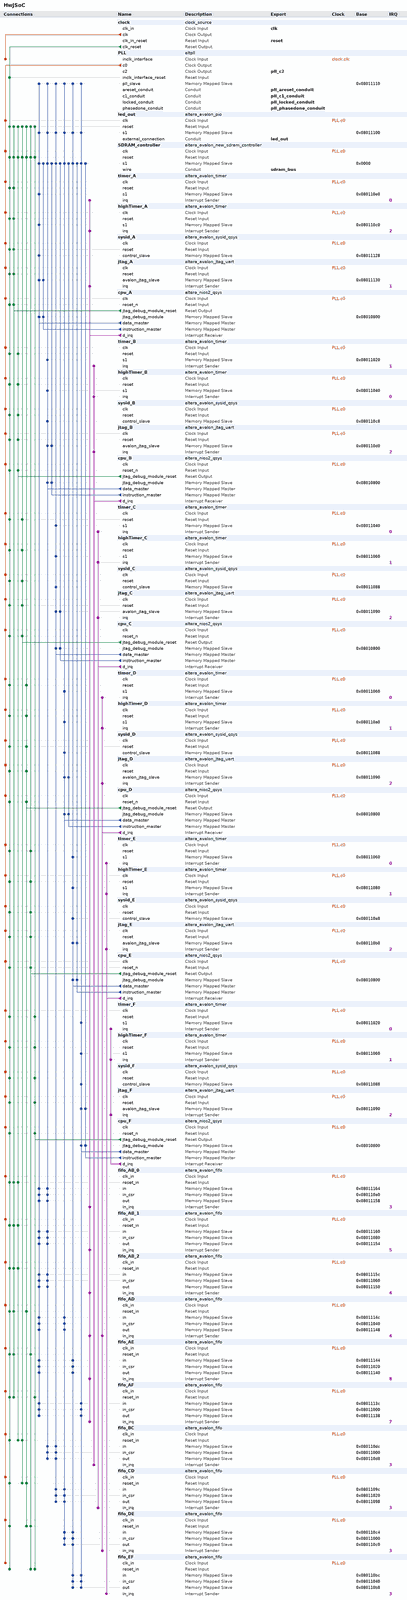
[diagram p0: system contents, whole]
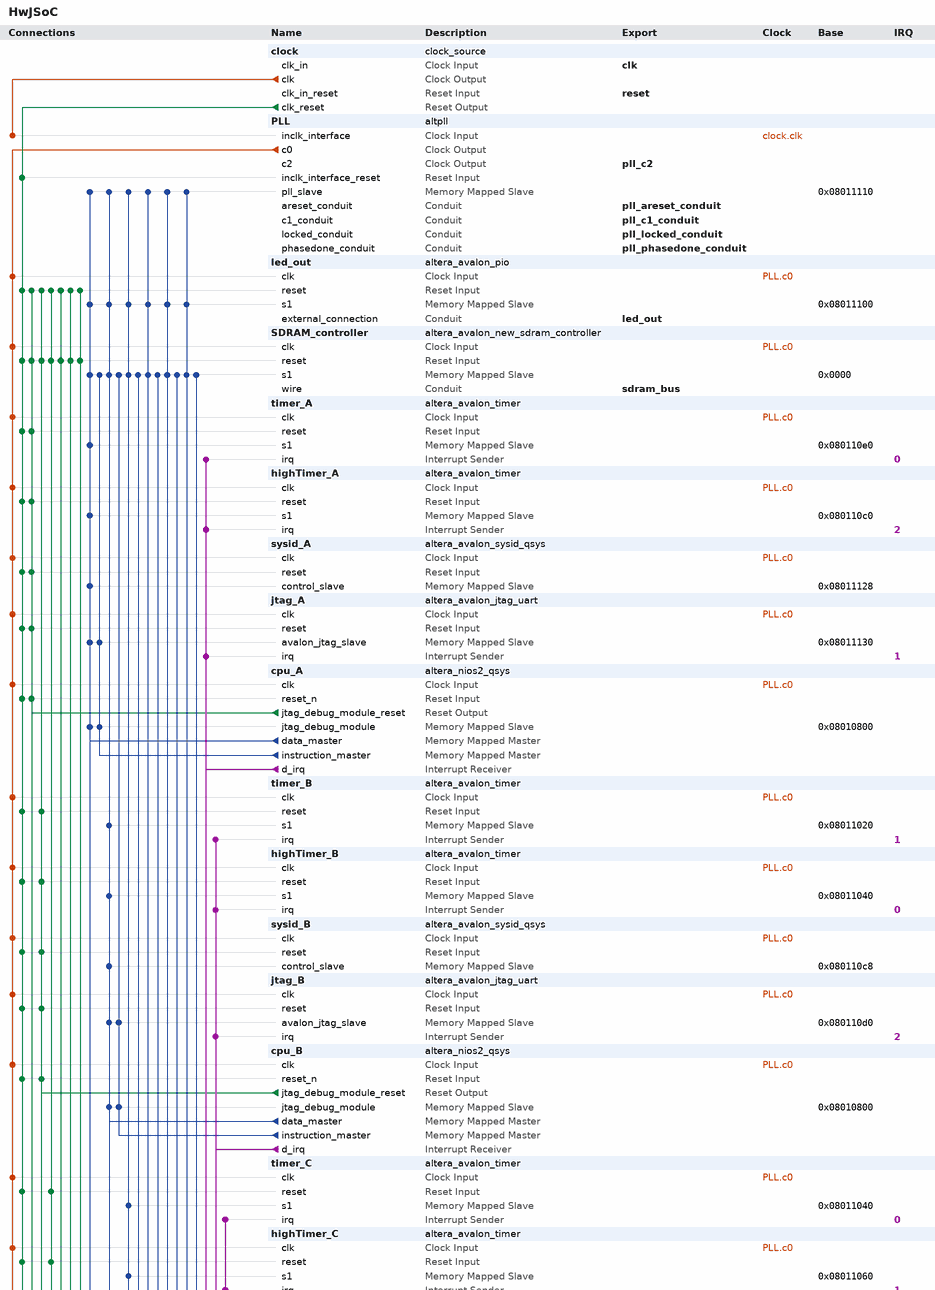
[diagram p1: system contents, upper part]
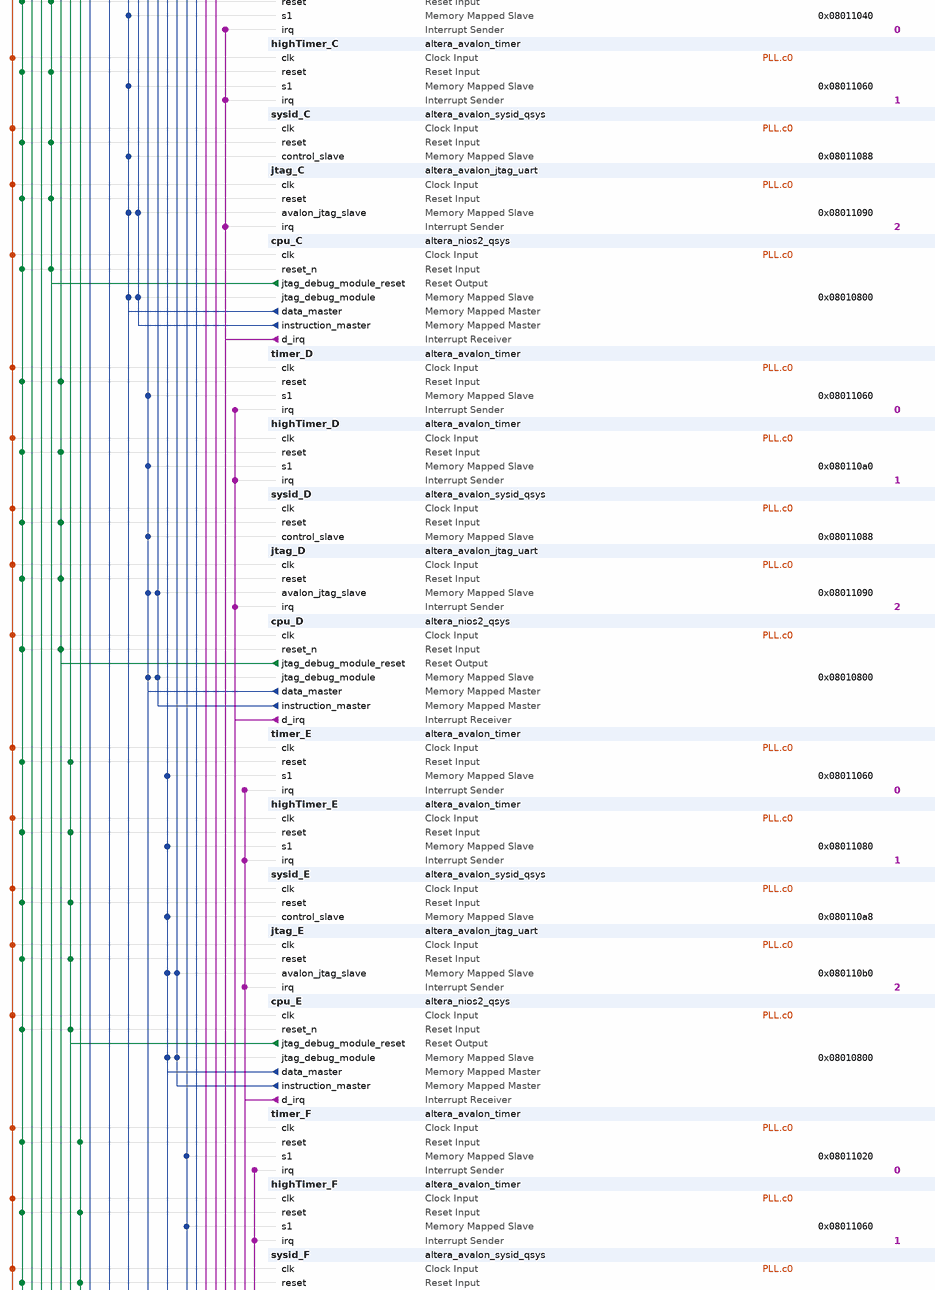
[diagram p2: system contents, middle part]
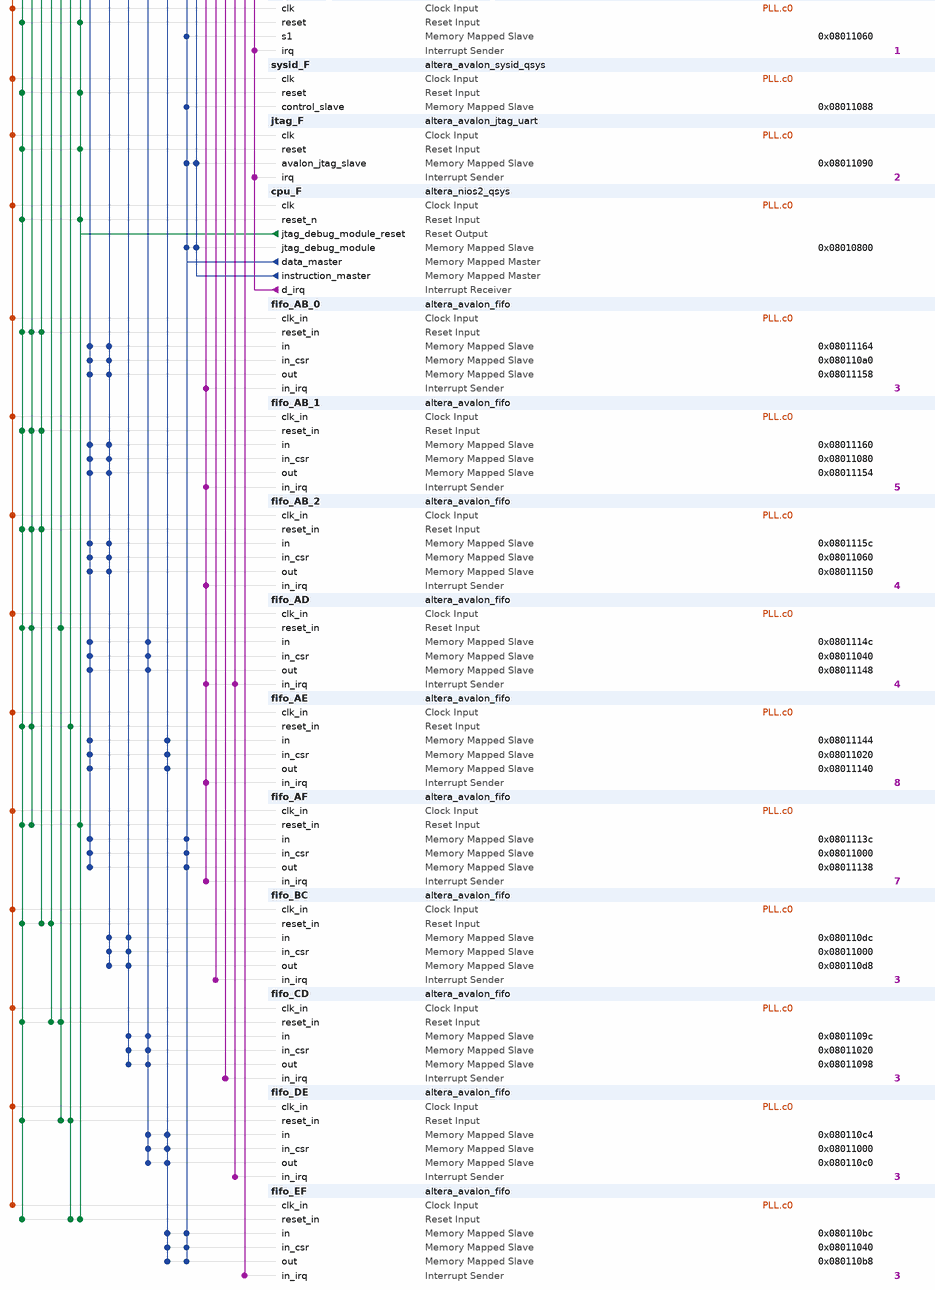
[diagram p3: system contents, lower part]
# Platform Designer (Qsys) system HwJSoC, Cyclone IV E EP4CE115F29C7
# Parameters at their usual value, and those the tool derives, are not listed.
package require -exact qsys 13.1
create_system HwJSoC
set_project_property DEVICE_FAMILY {Cyclone IV E}
set_project_property DEVICE EP4CE115F29C7

add_instance clock clock_source 13.1
set_instance_parameter_value clock clockFrequency 50000000

add_instance PLL altpll 13.1
set_instance_parameter_value PLL INCLK0_INPUT_FREQUENCY 10000
set_instance_parameter_value PLL CLK0_MULTIPLY_BY 1
set_instance_parameter_value PLL CLK1_MULTIPLY_BY 1
set_instance_parameter_value PLL CLK2_MULTIPLY_BY 1
set_instance_parameter_value PLL CLK0_DIVIDE_BY 1
set_instance_parameter_value PLL CLK1_DIVIDE_BY 10
set_instance_parameter_value PLL CLK2_DIVIDE_BY 1
set_instance_parameter_value PLL CLK1_PHASE_SHIFT 0
set_instance_parameter_value PLL CLK2_PHASE_SHIFT -1806
set_instance_parameter_value PLL CLK1_DUTY_CYCLE 50
set_instance_parameter_value PLL CLK2_DUTY_CYCLE 50
set_instance_parameter_value PLL PORT_clk1 PORT_UNUSED
set_instance_parameter_value PLL PORT_clk2 PORT_USED
set_instance_parameter_value PLL PORT_clk3 PORT_UNUSED
set_instance_parameter_value PLL PORT_ARESET PORT_USED
set_instance_parameter_value PLL PORT_LOCKED PORT_USED

add_instance led_out altera_avalon_pio 13.1
set_instance_parameter_value led_out direction Output
set_instance_parameter_value led_out width 8

add_instance SDRAM_controller altera_avalon_new_sdram_controller 13.1
set_instance_parameter_value SDRAM_controller TAC 6.0
set_instance_parameter_value SDRAM_controller TRCD 20.0
set_instance_parameter_value SDRAM_controller TRP 20.0
set_instance_parameter_value SDRAM_controller casLatency 3
set_instance_parameter_value SDRAM_controller columnWidth 10
set_instance_parameter_value SDRAM_controller dataWidth 32
set_instance_parameter_value SDRAM_controller generateSimulationModel false
set_instance_parameter_value SDRAM_controller model single_Micron_MT48LC4M32B2_7_chip
set_instance_parameter_value SDRAM_controller numberOfBanks 4
set_instance_parameter_value SDRAM_controller numberOfChipSelects 1
set_instance_parameter_value SDRAM_controller powerUpDelay 100.0
set_instance_parameter_value SDRAM_controller refreshPeriod 15.625
set_instance_parameter_value SDRAM_controller rowWidth 13

add_instance timer_A altera_avalon_timer 13.1
set_instance_parameter_value timer_A period 1
set_instance_parameter_value timer_A periodUnits MSEC

add_instance highTimer_A altera_avalon_timer 13.1
set_instance_parameter_value highTimer_A period 1
set_instance_parameter_value highTimer_A periodUnits USEC

add_instance sysid_A altera_avalon_sysid_qsys 13.1
set_instance_parameter_value sysid_A id 16

add_instance jtag_A altera_avalon_jtag_uart 13.1
set_instance_parameter_value jtag_A simInteractiveOptions NO_INTERACTIVE_WINDOWS

add_instance cpu_A altera_nios2_qsys 13.1
set_instance_parameter_value cpu_A resetSlave SDRAM_controller.s1
set_instance_parameter_value cpu_A mmu_TLBMissExcSlave None
set_instance_parameter_value cpu_A exceptionSlave SDRAM_controller.s1
set_instance_parameter_value cpu_A breakSlave cpu_A.jtag_debug_module
set_instance_parameter_value cpu_A muldiv_multiplierType NoneSmall
set_instance_parameter_value cpu_A impl Small
set_instance_parameter_value cpu_A icache_size 4096

add_instance timer_B altera_avalon_timer 13.1
set_instance_parameter_value timer_B period 1
set_instance_parameter_value timer_B periodUnits MSEC

add_instance highTimer_B altera_avalon_timer 13.1
set_instance_parameter_value highTimer_B period 1
set_instance_parameter_value highTimer_B periodUnits USEC

add_instance sysid_B altera_avalon_sysid_qsys 13.1
set_instance_parameter_value sysid_B id 16

add_instance jtag_B altera_avalon_jtag_uart 13.1
set_instance_parameter_value jtag_B simInteractiveOptions NO_INTERACTIVE_WINDOWS

add_instance cpu_B altera_nios2_qsys 13.1
set_instance_parameter_value cpu_B resetOffset 131072
set_instance_parameter_value cpu_B exceptionOffset 131104
set_instance_parameter_value cpu_B resetSlave SDRAM_controller.s1
set_instance_parameter_value cpu_B mmu_TLBMissExcSlave None
set_instance_parameter_value cpu_B exceptionSlave SDRAM_controller.s1
set_instance_parameter_value cpu_B breakSlave cpu_B.jtag_debug_module
set_instance_parameter_value cpu_B muldiv_multiplierType NoneSmall
set_instance_parameter_value cpu_B impl Small
set_instance_parameter_value cpu_B icache_size 4096

add_instance timer_C altera_avalon_timer 13.1
set_instance_parameter_value timer_C period 1
set_instance_parameter_value timer_C periodUnits MSEC

add_instance highTimer_C altera_avalon_timer 13.1
set_instance_parameter_value highTimer_C period 1
set_instance_parameter_value highTimer_C periodUnits USEC

add_instance sysid_C altera_avalon_sysid_qsys 13.1
set_instance_parameter_value sysid_C id 16

add_instance jtag_C altera_avalon_jtag_uart 13.1
set_instance_parameter_value jtag_C simInteractiveOptions NO_INTERACTIVE_WINDOWS

add_instance cpu_C altera_nios2_qsys 13.1
set_instance_parameter_value cpu_C resetOffset 262144
set_instance_parameter_value cpu_C exceptionOffset 262176
set_instance_parameter_value cpu_C resetSlave SDRAM_controller.s1
set_instance_parameter_value cpu_C mmu_TLBMissExcSlave None
set_instance_parameter_value cpu_C exceptionSlave SDRAM_controller.s1
set_instance_parameter_value cpu_C breakSlave cpu_C.jtag_debug_module
set_instance_parameter_value cpu_C impl Small
set_instance_parameter_value cpu_C icache_size 4096

add_instance timer_D altera_avalon_timer 13.1
set_instance_parameter_value timer_D period 1
set_instance_parameter_value timer_D periodUnits MSEC

add_instance highTimer_D altera_avalon_timer 13.1
set_instance_parameter_value highTimer_D period 1
set_instance_parameter_value highTimer_D periodUnits USEC

add_instance sysid_D altera_avalon_sysid_qsys 13.1
set_instance_parameter_value sysid_D id 16

add_instance jtag_D altera_avalon_jtag_uart 13.1
set_instance_parameter_value jtag_D simInteractiveOptions NO_INTERACTIVE_WINDOWS

add_instance cpu_D altera_nios2_qsys 13.1
set_instance_parameter_value cpu_D resetOffset 393216
set_instance_parameter_value cpu_D exceptionOffset 393248
set_instance_parameter_value cpu_D resetSlave SDRAM_controller.s1
set_instance_parameter_value cpu_D mmu_TLBMissExcSlave None
set_instance_parameter_value cpu_D exceptionSlave SDRAM_controller.s1
set_instance_parameter_value cpu_D breakSlave cpu_D.jtag_debug_module
set_instance_parameter_value cpu_D muldiv_multiplierType NoneSmall
set_instance_parameter_value cpu_D impl Small
set_instance_parameter_value cpu_D icache_size 4096

add_instance timer_E altera_avalon_timer 13.1
set_instance_parameter_value timer_E period 1
set_instance_parameter_value timer_E periodUnits MSEC

add_instance highTimer_E altera_avalon_timer 13.1
set_instance_parameter_value highTimer_E period 1
set_instance_parameter_value highTimer_E periodUnits USEC

add_instance sysid_E altera_avalon_sysid_qsys 13.1
set_instance_parameter_value sysid_E id 16

add_instance jtag_E altera_avalon_jtag_uart 13.1
set_instance_parameter_value jtag_E simInteractiveOptions NO_INTERACTIVE_WINDOWS

add_instance cpu_E altera_nios2_qsys 13.1
set_instance_parameter_value cpu_E resetOffset 524288
set_instance_parameter_value cpu_E exceptionOffset 524320
set_instance_parameter_value cpu_E resetSlave SDRAM_controller.s1
set_instance_parameter_value cpu_E mmu_TLBMissExcSlave None
set_instance_parameter_value cpu_E exceptionSlave SDRAM_controller.s1
set_instance_parameter_value cpu_E breakSlave cpu_E.jtag_debug_module
set_instance_parameter_value cpu_E muldiv_multiplierType NoneSmall
set_instance_parameter_value cpu_E impl Small
set_instance_parameter_value cpu_E icache_size 4096

add_instance timer_F altera_avalon_timer 13.1
set_instance_parameter_value timer_F period 1
set_instance_parameter_value timer_F periodUnits MSEC

add_instance highTimer_F altera_avalon_timer 13.1
set_instance_parameter_value highTimer_F period 1
set_instance_parameter_value highTimer_F periodUnits USEC

add_instance sysid_F altera_avalon_sysid_qsys 13.1
set_instance_parameter_value sysid_F id 16

add_instance jtag_F altera_avalon_jtag_uart 13.1
set_instance_parameter_value jtag_F simInteractiveOptions NO_INTERACTIVE_WINDOWS

add_instance cpu_F altera_nios2_qsys 13.1
set_instance_parameter_value cpu_F resetOffset 655360
set_instance_parameter_value cpu_F exceptionOffset 655392
set_instance_parameter_value cpu_F resetSlave SDRAM_controller.s1
set_instance_parameter_value cpu_F mmu_TLBMissExcSlave None
set_instance_parameter_value cpu_F exceptionSlave SDRAM_controller.s1
set_instance_parameter_value cpu_F breakSlave cpu_F.jtag_debug_module
set_instance_parameter_value cpu_F muldiv_multiplierType NoneSmall
set_instance_parameter_value cpu_F impl Small
set_instance_parameter_value cpu_F icache_size 4096

add_instance fifo_AB_0 altera_avalon_fifo 13.1
set_instance_parameter_value fifo_AB_0 bitsPerSymbol 16
set_instance_parameter_value fifo_AB_0 channelWidth 8
set_instance_parameter_value fifo_AB_0 errorWidth 8
set_instance_parameter_value fifo_AB_0 fifoDepth 128
set_instance_parameter_value fifo_AB_0 fifoInputInterfaceOptions AVALONMM_WRITE
set_instance_parameter_value fifo_AB_0 fifoOutputInterfaceOptions AVALONMM_READ
set_instance_parameter_value fifo_AB_0 singleClockMode true
set_instance_parameter_value fifo_AB_0 symbolsPerBeat 2
set_instance_parameter_value fifo_AB_0 useIRQ true
set_instance_parameter_value fifo_AB_0 usePacket true
set_instance_parameter_value fifo_AB_0 useReadControl false

add_instance fifo_AB_1 altera_avalon_fifo 13.1
set_instance_parameter_value fifo_AB_1 bitsPerSymbol 16
set_instance_parameter_value fifo_AB_1 channelWidth 8
set_instance_parameter_value fifo_AB_1 errorWidth 8
set_instance_parameter_value fifo_AB_1 fifoDepth 128
set_instance_parameter_value fifo_AB_1 fifoInputInterfaceOptions AVALONMM_WRITE
set_instance_parameter_value fifo_AB_1 fifoOutputInterfaceOptions AVALONMM_READ
set_instance_parameter_value fifo_AB_1 singleClockMode true
set_instance_parameter_value fifo_AB_1 symbolsPerBeat 2
set_instance_parameter_value fifo_AB_1 useIRQ true
set_instance_parameter_value fifo_AB_1 usePacket true
set_instance_parameter_value fifo_AB_1 useReadControl false

add_instance fifo_AB_2 altera_avalon_fifo 13.1
set_instance_parameter_value fifo_AB_2 bitsPerSymbol 16
set_instance_parameter_value fifo_AB_2 channelWidth 8
set_instance_parameter_value fifo_AB_2 errorWidth 8
set_instance_parameter_value fifo_AB_2 fifoDepth 128
set_instance_parameter_value fifo_AB_2 fifoInputInterfaceOptions AVALONMM_WRITE
set_instance_parameter_value fifo_AB_2 fifoOutputInterfaceOptions AVALONMM_READ
set_instance_parameter_value fifo_AB_2 singleClockMode true
set_instance_parameter_value fifo_AB_2 symbolsPerBeat 2
set_instance_parameter_value fifo_AB_2 useIRQ true
set_instance_parameter_value fifo_AB_2 usePacket true
set_instance_parameter_value fifo_AB_2 useReadControl false

add_instance fifo_AD altera_avalon_fifo 13.1
set_instance_parameter_value fifo_AD bitsPerSymbol 16
set_instance_parameter_value fifo_AD channelWidth 8
set_instance_parameter_value fifo_AD errorWidth 8
set_instance_parameter_value fifo_AD fifoDepth 32
set_instance_parameter_value fifo_AD fifoInputInterfaceOptions AVALONMM_WRITE
set_instance_parameter_value fifo_AD fifoOutputInterfaceOptions AVALONMM_READ
set_instance_parameter_value fifo_AD singleClockMode true
set_instance_parameter_value fifo_AD symbolsPerBeat 2
set_instance_parameter_value fifo_AD useIRQ true
set_instance_parameter_value fifo_AD usePacket true
set_instance_parameter_value fifo_AD useReadControl false

add_instance fifo_AE altera_avalon_fifo 13.1
set_instance_parameter_value fifo_AE bitsPerSymbol 16
set_instance_parameter_value fifo_AE channelWidth 8
set_instance_parameter_value fifo_AE errorWidth 8
set_instance_parameter_value fifo_AE fifoDepth 32
set_instance_parameter_value fifo_AE fifoInputInterfaceOptions AVALONMM_WRITE
set_instance_parameter_value fifo_AE fifoOutputInterfaceOptions AVALONMM_READ
set_instance_parameter_value fifo_AE singleClockMode true
set_instance_parameter_value fifo_AE symbolsPerBeat 2
set_instance_parameter_value fifo_AE useIRQ true
set_instance_parameter_value fifo_AE usePacket true
set_instance_parameter_value fifo_AE useReadControl false

add_instance fifo_AF altera_avalon_fifo 13.1
set_instance_parameter_value fifo_AF bitsPerSymbol 16
set_instance_parameter_value fifo_AF channelWidth 8
set_instance_parameter_value fifo_AF errorWidth 8
set_instance_parameter_value fifo_AF fifoDepth 32
set_instance_parameter_value fifo_AF fifoInputInterfaceOptions AVALONMM_WRITE
set_instance_parameter_value fifo_AF fifoOutputInterfaceOptions AVALONMM_READ
set_instance_parameter_value fifo_AF singleClockMode true
set_instance_parameter_value fifo_AF symbolsPerBeat 2
set_instance_parameter_value fifo_AF useIRQ true
set_instance_parameter_value fifo_AF usePacket true
set_instance_parameter_value fifo_AF useReadControl false

add_instance fifo_BC altera_avalon_fifo 13.1
set_instance_parameter_value fifo_BC bitsPerSymbol 16
set_instance_parameter_value fifo_BC channelWidth 8
set_instance_parameter_value fifo_BC errorWidth 8
set_instance_parameter_value fifo_BC fifoDepth 256
set_instance_parameter_value fifo_BC fifoInputInterfaceOptions AVALONMM_WRITE
set_instance_parameter_value fifo_BC fifoOutputInterfaceOptions AVALONMM_READ
set_instance_parameter_value fifo_BC singleClockMode true
set_instance_parameter_value fifo_BC symbolsPerBeat 2
set_instance_parameter_value fifo_BC useIRQ true
set_instance_parameter_value fifo_BC usePacket true
set_instance_parameter_value fifo_BC useReadControl false

add_instance fifo_CD altera_avalon_fifo 13.1
set_instance_parameter_value fifo_CD bitsPerSymbol 16
set_instance_parameter_value fifo_CD channelWidth 8
set_instance_parameter_value fifo_CD errorWidth 8
set_instance_parameter_value fifo_CD fifoDepth 256
set_instance_parameter_value fifo_CD fifoInputInterfaceOptions AVALONMM_WRITE
set_instance_parameter_value fifo_CD fifoOutputInterfaceOptions AVALONMM_READ
set_instance_parameter_value fifo_CD singleClockMode true
set_instance_parameter_value fifo_CD symbolsPerBeat 2
set_instance_parameter_value fifo_CD useIRQ true
set_instance_parameter_value fifo_CD usePacket true
set_instance_parameter_value fifo_CD useReadControl false

add_instance fifo_DE altera_avalon_fifo 13.1
set_instance_parameter_value fifo_DE bitsPerSymbol 16
set_instance_parameter_value fifo_DE channelWidth 8
set_instance_parameter_value fifo_DE errorWidth 8
set_instance_parameter_value fifo_DE fifoDepth 256
set_instance_parameter_value fifo_DE fifoInputInterfaceOptions AVALONMM_WRITE
set_instance_parameter_value fifo_DE fifoOutputInterfaceOptions AVALONMM_READ
set_instance_parameter_value fifo_DE singleClockMode true
set_instance_parameter_value fifo_DE symbolsPerBeat 2
set_instance_parameter_value fifo_DE useIRQ true
set_instance_parameter_value fifo_DE usePacket true
set_instance_parameter_value fifo_DE useReadControl false

add_instance fifo_EF altera_avalon_fifo 13.1
set_instance_parameter_value fifo_EF bitsPerSymbol 16
set_instance_parameter_value fifo_EF channelWidth 8
set_instance_parameter_value fifo_EF errorWidth 8
set_instance_parameter_value fifo_EF fifoDepth 512
set_instance_parameter_value fifo_EF fifoInputInterfaceOptions AVALONMM_WRITE
set_instance_parameter_value fifo_EF fifoOutputInterfaceOptions AVALONMM_READ
set_instance_parameter_value fifo_EF singleClockMode true
set_instance_parameter_value fifo_EF symbolsPerBeat 2
set_instance_parameter_value fifo_EF useIRQ true
set_instance_parameter_value fifo_EF usePacket true
set_instance_parameter_value fifo_EF useReadControl false

# connections
add_connection clock.clk PLL.inclk_interface clock
add_connection PLL.c0 cpu_A.clk clock
add_connection PLL.c0 cpu_B.clk clock
add_connection PLL.c0 cpu_C.clk clock
add_connection PLL.c0 cpu_D.clk clock
add_connection PLL.c0 cpu_E.clk clock
add_connection PLL.c0 cpu_F.clk clock
add_connection PLL.c0 fifo_AB_0.clk_in clock
add_connection PLL.c0 fifo_AB_1.clk_in clock
add_connection PLL.c0 fifo_AB_2.clk_in clock
add_connection PLL.c0 fifo_AD.clk_in clock
add_connection PLL.c0 fifo_AE.clk_in clock
add_connection PLL.c0 fifo_AF.clk_in clock
add_connection PLL.c0 fifo_BC.clk_in clock
add_connection PLL.c0 fifo_CD.clk_in clock
add_connection PLL.c0 fifo_DE.clk_in clock
add_connection PLL.c0 fifo_EF.clk_in clock
add_connection PLL.c0 highTimer_A.clk clock
add_connection PLL.c0 highTimer_B.clk clock
add_connection PLL.c0 highTimer_C.clk clock
add_connection PLL.c0 highTimer_D.clk clock
add_connection PLL.c0 highTimer_E.clk clock
add_connection PLL.c0 highTimer_F.clk clock
add_connection PLL.c0 jtag_A.clk clock
add_connection PLL.c0 jtag_B.clk clock
add_connection PLL.c0 jtag_C.clk clock
add_connection PLL.c0 jtag_D.clk clock
add_connection PLL.c0 jtag_E.clk clock
add_connection PLL.c0 jtag_F.clk clock
add_connection PLL.c0 led_out.clk clock
add_connection PLL.c0 SDRAM_controller.clk clock
add_connection PLL.c0 sysid_A.clk clock
add_connection PLL.c0 sysid_B.clk clock
add_connection PLL.c0 sysid_C.clk clock
add_connection PLL.c0 sysid_D.clk clock
add_connection PLL.c0 sysid_E.clk clock
add_connection PLL.c0 sysid_F.clk clock
add_connection PLL.c0 timer_A.clk clock
add_connection PLL.c0 timer_B.clk clock
add_connection PLL.c0 timer_C.clk clock
add_connection PLL.c0 timer_D.clk clock
add_connection PLL.c0 timer_E.clk clock
add_connection PLL.c0 timer_F.clk clock
add_connection clock.clk_reset cpu_A.reset_n reset
add_connection clock.clk_reset cpu_B.reset_n reset
add_connection clock.clk_reset cpu_C.reset_n reset
add_connection clock.clk_reset cpu_D.reset_n reset
add_connection clock.clk_reset cpu_E.reset_n reset
add_connection clock.clk_reset cpu_F.reset_n reset
add_connection clock.clk_reset fifo_AB_0.reset_in reset
add_connection clock.clk_reset fifo_AB_1.reset_in reset
add_connection clock.clk_reset fifo_AB_2.reset_in reset
add_connection clock.clk_reset fifo_AD.reset_in reset
add_connection clock.clk_reset fifo_AE.reset_in reset
add_connection clock.clk_reset fifo_AF.reset_in reset
add_connection clock.clk_reset fifo_BC.reset_in reset
add_connection clock.clk_reset fifo_CD.reset_in reset
add_connection clock.clk_reset fifo_DE.reset_in reset
add_connection clock.clk_reset fifo_EF.reset_in reset
add_connection clock.clk_reset highTimer_A.reset reset
add_connection clock.clk_reset highTimer_B.reset reset
add_connection clock.clk_reset highTimer_C.reset reset
add_connection clock.clk_reset highTimer_D.reset reset
add_connection clock.clk_reset highTimer_E.reset reset
add_connection clock.clk_reset highTimer_F.reset reset
add_connection clock.clk_reset jtag_A.reset reset
add_connection clock.clk_reset jtag_B.reset reset
add_connection clock.clk_reset jtag_C.reset reset
add_connection clock.clk_reset jtag_D.reset reset
add_connection clock.clk_reset jtag_E.reset reset
add_connection clock.clk_reset jtag_F.reset reset
add_connection clock.clk_reset led_out.reset reset
add_connection clock.clk_reset PLL.inclk_interface_reset reset
add_connection clock.clk_reset SDRAM_controller.reset reset
add_connection clock.clk_reset sysid_A.reset reset
add_connection clock.clk_reset sysid_B.reset reset
add_connection clock.clk_reset sysid_C.reset reset
add_connection clock.clk_reset sysid_D.reset reset
add_connection clock.clk_reset sysid_E.reset reset
add_connection clock.clk_reset sysid_F.reset reset
add_connection clock.clk_reset timer_A.reset reset
add_connection clock.clk_reset timer_B.reset reset
add_connection clock.clk_reset timer_C.reset reset
add_connection clock.clk_reset timer_D.reset reset
add_connection clock.clk_reset timer_E.reset reset
add_connection clock.clk_reset timer_F.reset reset
add_connection cpu_A.jtag_debug_module_reset cpu_A.reset_n reset
add_connection cpu_A.jtag_debug_module_reset fifo_AB_0.reset_in reset
add_connection cpu_A.jtag_debug_module_reset fifo_AB_1.reset_in reset
add_connection cpu_A.jtag_debug_module_reset fifo_AB_2.reset_in reset
add_connection cpu_A.jtag_debug_module_reset fifo_AD.reset_in reset
add_connection cpu_A.jtag_debug_module_reset fifo_AE.reset_in reset
add_connection cpu_A.jtag_debug_module_reset fifo_AF.reset_in reset
add_connection cpu_A.jtag_debug_module_reset highTimer_A.reset reset
add_connection cpu_A.jtag_debug_module_reset jtag_A.reset reset
add_connection cpu_A.jtag_debug_module_reset led_out.reset reset
add_connection cpu_A.jtag_debug_module_reset SDRAM_controller.reset reset
add_connection cpu_A.jtag_debug_module_reset sysid_A.reset reset
add_connection cpu_A.jtag_debug_module_reset timer_A.reset reset
add_connection cpu_B.jtag_debug_module_reset cpu_B.reset_n reset
add_connection cpu_B.jtag_debug_module_reset fifo_AB_0.reset_in reset
add_connection cpu_B.jtag_debug_module_reset fifo_AB_1.reset_in reset
add_connection cpu_B.jtag_debug_module_reset fifo_AB_2.reset_in reset
add_connection cpu_B.jtag_debug_module_reset fifo_BC.reset_in reset
add_connection cpu_B.jtag_debug_module_reset highTimer_B.reset reset
add_connection cpu_B.jtag_debug_module_reset jtag_B.reset reset
add_connection cpu_B.jtag_debug_module_reset led_out.reset reset
add_connection cpu_B.jtag_debug_module_reset SDRAM_controller.reset reset
add_connection cpu_B.jtag_debug_module_reset sysid_B.reset reset
add_connection cpu_B.jtag_debug_module_reset timer_B.reset reset
add_connection cpu_C.jtag_debug_module_reset cpu_C.reset_n reset
add_connection cpu_C.jtag_debug_module_reset fifo_BC.reset_in reset
add_connection cpu_C.jtag_debug_module_reset fifo_CD.reset_in reset
add_connection cpu_C.jtag_debug_module_reset highTimer_C.reset reset
add_connection cpu_C.jtag_debug_module_reset jtag_C.reset reset
add_connection cpu_C.jtag_debug_module_reset led_out.reset reset
add_connection cpu_C.jtag_debug_module_reset SDRAM_controller.reset reset
add_connection cpu_C.jtag_debug_module_reset sysid_C.reset reset
add_connection cpu_C.jtag_debug_module_reset timer_C.reset reset
add_connection cpu_D.jtag_debug_module_reset cpu_D.reset_n reset
add_connection cpu_D.jtag_debug_module_reset fifo_AD.reset_in reset
add_connection cpu_D.jtag_debug_module_reset fifo_CD.reset_in reset
add_connection cpu_D.jtag_debug_module_reset fifo_DE.reset_in reset
add_connection cpu_D.jtag_debug_module_reset highTimer_D.reset reset
add_connection cpu_D.jtag_debug_module_reset jtag_D.reset reset
add_connection cpu_D.jtag_debug_module_reset led_out.reset reset
add_connection cpu_D.jtag_debug_module_reset SDRAM_controller.reset reset
add_connection cpu_D.jtag_debug_module_reset sysid_D.reset reset
add_connection cpu_D.jtag_debug_module_reset timer_D.reset reset
add_connection cpu_E.jtag_debug_module_reset cpu_E.reset_n reset
add_connection cpu_E.jtag_debug_module_reset fifo_AE.reset_in reset
add_connection cpu_E.jtag_debug_module_reset fifo_DE.reset_in reset
add_connection cpu_E.jtag_debug_module_reset fifo_EF.reset_in reset
add_connection cpu_E.jtag_debug_module_reset highTimer_E.reset reset
add_connection cpu_E.jtag_debug_module_reset jtag_E.reset reset
add_connection cpu_E.jtag_debug_module_reset led_out.reset reset
add_connection cpu_E.jtag_debug_module_reset SDRAM_controller.reset reset
add_connection cpu_E.jtag_debug_module_reset sysid_E.reset reset
add_connection cpu_E.jtag_debug_module_reset timer_E.reset reset
add_connection cpu_F.jtag_debug_module_reset cpu_F.reset_n reset
add_connection cpu_F.jtag_debug_module_reset fifo_AF.reset_in reset
add_connection cpu_F.jtag_debug_module_reset fifo_EF.reset_in reset
add_connection cpu_F.jtag_debug_module_reset highTimer_F.reset reset
add_connection cpu_F.jtag_debug_module_reset jtag_F.reset reset
add_connection cpu_F.jtag_debug_module_reset led_out.reset reset
add_connection cpu_F.jtag_debug_module_reset SDRAM_controller.reset reset
add_connection cpu_F.jtag_debug_module_reset sysid_F.reset reset
add_connection cpu_F.jtag_debug_module_reset timer_F.reset reset
add_connection cpu_A.data_master cpu_A.jtag_debug_module avalon
set_connection_parameter_value cpu_A.data_master/cpu_A.jtag_debug_module baseAddress 0x08010800
add_connection cpu_A.data_master fifo_AB_0.in avalon
set_connection_parameter_value cpu_A.data_master/fifo_AB_0.in baseAddress 0x08011164
add_connection cpu_A.data_master fifo_AB_0.in_csr avalon
set_connection_parameter_value cpu_A.data_master/fifo_AB_0.in_csr baseAddress 0x080110a0
add_connection cpu_A.data_master fifo_AB_0.out avalon
set_connection_parameter_value cpu_A.data_master/fifo_AB_0.out baseAddress 0x08011158
add_connection cpu_A.data_master fifo_AB_1.in avalon
set_connection_parameter_value cpu_A.data_master/fifo_AB_1.in baseAddress 0x08011160
add_connection cpu_A.data_master fifo_AB_1.in_csr avalon
set_connection_parameter_value cpu_A.data_master/fifo_AB_1.in_csr baseAddress 0x08011080
add_connection cpu_A.data_master fifo_AB_1.out avalon
set_connection_parameter_value cpu_A.data_master/fifo_AB_1.out baseAddress 0x08011154
add_connection cpu_A.data_master fifo_AB_2.in avalon
set_connection_parameter_value cpu_A.data_master/fifo_AB_2.in baseAddress 0x0801115c
add_connection cpu_A.data_master fifo_AB_2.in_csr avalon
set_connection_parameter_value cpu_A.data_master/fifo_AB_2.in_csr baseAddress 0x08011060
add_connection cpu_A.data_master fifo_AB_2.out avalon
set_connection_parameter_value cpu_A.data_master/fifo_AB_2.out baseAddress 0x08011150
add_connection cpu_A.data_master fifo_AD.in avalon
set_connection_parameter_value cpu_A.data_master/fifo_AD.in baseAddress 0x0801114c
add_connection cpu_A.data_master fifo_AD.in_csr avalon
set_connection_parameter_value cpu_A.data_master/fifo_AD.in_csr baseAddress 0x08011040
add_connection cpu_A.data_master fifo_AD.out avalon
set_connection_parameter_value cpu_A.data_master/fifo_AD.out baseAddress 0x08011148
add_connection cpu_A.data_master fifo_AE.in avalon
set_connection_parameter_value cpu_A.data_master/fifo_AE.in baseAddress 0x08011144
add_connection cpu_A.data_master fifo_AE.in_csr avalon
set_connection_parameter_value cpu_A.data_master/fifo_AE.in_csr baseAddress 0x08011020
add_connection cpu_A.data_master fifo_AE.out avalon
set_connection_parameter_value cpu_A.data_master/fifo_AE.out baseAddress 0x08011140
add_connection cpu_A.data_master fifo_AF.in avalon
set_connection_parameter_value cpu_A.data_master/fifo_AF.in baseAddress 0x0801113c
add_connection cpu_A.data_master fifo_AF.in_csr avalon
set_connection_parameter_value cpu_A.data_master/fifo_AF.in_csr baseAddress 0x08011000
add_connection cpu_A.data_master fifo_AF.out avalon
set_connection_parameter_value cpu_A.data_master/fifo_AF.out baseAddress 0x08011138
add_connection cpu_A.data_master highTimer_A.s1 avalon
set_connection_parameter_value cpu_A.data_master/highTimer_A.s1 baseAddress 0x080110c0
add_connection cpu_A.data_master jtag_A.avalon_jtag_slave avalon
set_connection_parameter_value cpu_A.data_master/jtag_A.avalon_jtag_slave baseAddress 0x08011130
add_connection cpu_A.data_master led_out.s1 avalon
set_connection_parameter_value cpu_A.data_master/led_out.s1 baseAddress 0x08011100
add_connection cpu_A.data_master PLL.pll_slave avalon
set_connection_parameter_value cpu_A.data_master/PLL.pll_slave baseAddress 0x08011110
add_connection cpu_A.data_master SDRAM_controller.s1 avalon
set_connection_parameter_value cpu_A.data_master/SDRAM_controller.s1 baseAddress 0x0000
add_connection cpu_A.data_master sysid_A.control_slave avalon
set_connection_parameter_value cpu_A.data_master/sysid_A.control_slave baseAddress 0x08011128
add_connection cpu_A.data_master timer_A.s1 avalon
set_connection_parameter_value cpu_A.data_master/timer_A.s1 baseAddress 0x080110e0
add_connection cpu_A.instruction_master cpu_A.jtag_debug_module avalon
set_connection_parameter_value cpu_A.instruction_master/cpu_A.jtag_debug_module baseAddress 0x08010800
add_connection cpu_A.instruction_master jtag_A.avalon_jtag_slave avalon
set_connection_parameter_value cpu_A.instruction_master/jtag_A.avalon_jtag_slave baseAddress 0x08011130
add_connection cpu_A.instruction_master SDRAM_controller.s1 avalon
set_connection_parameter_value cpu_A.instruction_master/SDRAM_controller.s1 baseAddress 0x0000
add_connection cpu_B.data_master cpu_B.jtag_debug_module avalon
set_connection_parameter_value cpu_B.data_master/cpu_B.jtag_debug_module baseAddress 0x08010800
add_connection cpu_B.data_master fifo_AB_0.in avalon
set_connection_parameter_value cpu_B.data_master/fifo_AB_0.in baseAddress 0x08011164
add_connection cpu_B.data_master fifo_AB_0.in_csr avalon
set_connection_parameter_value cpu_B.data_master/fifo_AB_0.in_csr baseAddress 0x080110a0
add_connection cpu_B.data_master fifo_AB_0.out avalon
set_connection_parameter_value cpu_B.data_master/fifo_AB_0.out baseAddress 0x08011158
add_connection cpu_B.data_master fifo_AB_1.in avalon
set_connection_parameter_value cpu_B.data_master/fifo_AB_1.in baseAddress 0x08011160
add_connection cpu_B.data_master fifo_AB_1.in_csr avalon
set_connection_parameter_value cpu_B.data_master/fifo_AB_1.in_csr baseAddress 0x08011080
add_connection cpu_B.data_master fifo_AB_1.out avalon
set_connection_parameter_value cpu_B.data_master/fifo_AB_1.out baseAddress 0x08011154
add_connection cpu_B.data_master fifo_AB_2.in avalon
set_connection_parameter_value cpu_B.data_master/fifo_AB_2.in baseAddress 0x0801115c
add_connection cpu_B.data_master fifo_AB_2.in_csr avalon
set_connection_parameter_value cpu_B.data_master/fifo_AB_2.in_csr baseAddress 0x08011060
add_connection cpu_B.data_master fifo_AB_2.out avalon
set_connection_parameter_value cpu_B.data_master/fifo_AB_2.out baseAddress 0x08011150
add_connection cpu_B.data_master fifo_BC.in avalon
set_connection_parameter_value cpu_B.data_master/fifo_BC.in baseAddress 0x080110dc
add_connection cpu_B.data_master fifo_BC.in_csr avalon
set_connection_parameter_value cpu_B.data_master/fifo_BC.in_csr baseAddress 0x08011000
add_connection cpu_B.data_master fifo_BC.out avalon
set_connection_parameter_value cpu_B.data_master/fifo_BC.out baseAddress 0x080110d8
add_connection cpu_B.data_master highTimer_B.s1 avalon
set_connection_parameter_value cpu_B.data_master/highTimer_B.s1 baseAddress 0x08011040
add_connection cpu_B.data_master jtag_B.avalon_jtag_slave avalon
set_connection_parameter_value cpu_B.data_master/jtag_B.avalon_jtag_slave baseAddress 0x080110d0
add_connection cpu_B.data_master led_out.s1 avalon
set_connection_parameter_value cpu_B.data_master/led_out.s1 baseAddress 0x08011100
add_connection cpu_B.data_master PLL.pll_slave avalon
set_connection_parameter_value cpu_B.data_master/PLL.pll_slave baseAddress 0x08011110
add_connection cpu_B.data_master SDRAM_controller.s1 avalon
set_connection_parameter_value cpu_B.data_master/SDRAM_controller.s1 baseAddress 0x0000
add_connection cpu_B.data_master sysid_B.control_slave avalon
set_connection_parameter_value cpu_B.data_master/sysid_B.control_slave baseAddress 0x080110c8
add_connection cpu_B.data_master timer_B.s1 avalon
set_connection_parameter_value cpu_B.data_master/timer_B.s1 baseAddress 0x08011020
add_connection cpu_B.instruction_master cpu_B.jtag_debug_module avalon
set_connection_parameter_value cpu_B.instruction_master/cpu_B.jtag_debug_module baseAddress 0x08010800
add_connection cpu_B.instruction_master jtag_B.avalon_jtag_slave avalon
set_connection_parameter_value cpu_B.instruction_master/jtag_B.avalon_jtag_slave baseAddress 0x080110d0
add_connection cpu_B.instruction_master SDRAM_controller.s1 avalon
set_connection_parameter_value cpu_B.instruction_master/SDRAM_controller.s1 baseAddress 0x0000
add_connection cpu_C.data_master cpu_C.jtag_debug_module avalon
set_connection_parameter_value cpu_C.data_master/cpu_C.jtag_debug_module baseAddress 0x08010800
add_connection cpu_C.data_master fifo_BC.in avalon
set_connection_parameter_value cpu_C.data_master/fifo_BC.in baseAddress 0x080110dc
add_connection cpu_C.data_master fifo_BC.in_csr avalon
set_connection_parameter_value cpu_C.data_master/fifo_BC.in_csr baseAddress 0x08011000
add_connection cpu_C.data_master fifo_BC.out avalon
set_connection_parameter_value cpu_C.data_master/fifo_BC.out baseAddress 0x080110d8
add_connection cpu_C.data_master fifo_CD.in avalon
set_connection_parameter_value cpu_C.data_master/fifo_CD.in baseAddress 0x0801109c
add_connection cpu_C.data_master fifo_CD.in_csr avalon
set_connection_parameter_value cpu_C.data_master/fifo_CD.in_csr baseAddress 0x08011020
add_connection cpu_C.data_master fifo_CD.out avalon
set_connection_parameter_value cpu_C.data_master/fifo_CD.out baseAddress 0x08011098
add_connection cpu_C.data_master highTimer_C.s1 avalon
set_connection_parameter_value cpu_C.data_master/highTimer_C.s1 baseAddress 0x08011060
add_connection cpu_C.data_master jtag_C.avalon_jtag_slave avalon
set_connection_parameter_value cpu_C.data_master/jtag_C.avalon_jtag_slave baseAddress 0x08011090
add_connection cpu_C.data_master led_out.s1 avalon
set_connection_parameter_value cpu_C.data_master/led_out.s1 baseAddress 0x08011100
add_connection cpu_C.data_master PLL.pll_slave avalon
set_connection_parameter_value cpu_C.data_master/PLL.pll_slave baseAddress 0x08011110
add_connection cpu_C.data_master SDRAM_controller.s1 avalon
set_connection_parameter_value cpu_C.data_master/SDRAM_controller.s1 baseAddress 0x0000
add_connection cpu_C.data_master sysid_C.control_slave avalon
set_connection_parameter_value cpu_C.data_master/sysid_C.control_slave baseAddress 0x08011088
add_connection cpu_C.data_master timer_C.s1 avalon
set_connection_parameter_value cpu_C.data_master/timer_C.s1 baseAddress 0x08011040
add_connection cpu_C.instruction_master cpu_C.jtag_debug_module avalon
set_connection_parameter_value cpu_C.instruction_master/cpu_C.jtag_debug_module baseAddress 0x08010800
add_connection cpu_C.instruction_master jtag_C.avalon_jtag_slave avalon
set_connection_parameter_value cpu_C.instruction_master/jtag_C.avalon_jtag_slave baseAddress 0x08011090
add_connection cpu_C.instruction_master SDRAM_controller.s1 avalon
set_connection_parameter_value cpu_C.instruction_master/SDRAM_controller.s1 baseAddress 0x0000
add_connection cpu_D.data_master cpu_D.jtag_debug_module avalon
set_connection_parameter_value cpu_D.data_master/cpu_D.jtag_debug_module baseAddress 0x08010800
add_connection cpu_D.data_master fifo_AD.in avalon
set_connection_parameter_value cpu_D.data_master/fifo_AD.in baseAddress 0x0801114c
add_connection cpu_D.data_master fifo_AD.in_csr avalon
set_connection_parameter_value cpu_D.data_master/fifo_AD.in_csr baseAddress 0x08011040
add_connection cpu_D.data_master fifo_AD.out avalon
set_connection_parameter_value cpu_D.data_master/fifo_AD.out baseAddress 0x08011148
add_connection cpu_D.data_master fifo_CD.in avalon
set_connection_parameter_value cpu_D.data_master/fifo_CD.in baseAddress 0x0801109c
add_connection cpu_D.data_master fifo_CD.in_csr avalon
set_connection_parameter_value cpu_D.data_master/fifo_CD.in_csr baseAddress 0x08011020
add_connection cpu_D.data_master fifo_CD.out avalon
set_connection_parameter_value cpu_D.data_master/fifo_CD.out baseAddress 0x08011098
add_connection cpu_D.data_master fifo_DE.in avalon
set_connection_parameter_value cpu_D.data_master/fifo_DE.in baseAddress 0x080110c4
add_connection cpu_D.data_master fifo_DE.in_csr avalon
set_connection_parameter_value cpu_D.data_master/fifo_DE.in_csr baseAddress 0x08011000
add_connection cpu_D.data_master fifo_DE.out avalon
set_connection_parameter_value cpu_D.data_master/fifo_DE.out baseAddress 0x080110c0
add_connection cpu_D.data_master highTimer_D.s1 avalon
set_connection_parameter_value cpu_D.data_master/highTimer_D.s1 baseAddress 0x080110a0
add_connection cpu_D.data_master jtag_D.avalon_jtag_slave avalon
set_connection_parameter_value cpu_D.data_master/jtag_D.avalon_jtag_slave baseAddress 0x08011090
add_connection cpu_D.data_master led_out.s1 avalon
set_connection_parameter_value cpu_D.data_master/led_out.s1 baseAddress 0x08011100
add_connection cpu_D.data_master PLL.pll_slave avalon
set_connection_parameter_value cpu_D.data_master/PLL.pll_slave baseAddress 0x08011110
add_connection cpu_D.data_master SDRAM_controller.s1 avalon
set_connection_parameter_value cpu_D.data_master/SDRAM_controller.s1 baseAddress 0x0000
add_connection cpu_D.data_master sysid_D.control_slave avalon
set_connection_parameter_value cpu_D.data_master/sysid_D.control_slave baseAddress 0x08011088
add_connection cpu_D.data_master timer_D.s1 avalon
set_connection_parameter_value cpu_D.data_master/timer_D.s1 baseAddress 0x08011060
add_connection cpu_D.instruction_master cpu_D.jtag_debug_module avalon
set_connection_parameter_value cpu_D.instruction_master/cpu_D.jtag_debug_module baseAddress 0x08010800
add_connection cpu_D.instruction_master jtag_D.avalon_jtag_slave avalon
set_connection_parameter_value cpu_D.instruction_master/jtag_D.avalon_jtag_slave baseAddress 0x08011090
add_connection cpu_D.instruction_master SDRAM_controller.s1 avalon
set_connection_parameter_value cpu_D.instruction_master/SDRAM_controller.s1 baseAddress 0x0000
add_connection cpu_E.data_master cpu_E.jtag_debug_module avalon
set_connection_parameter_value cpu_E.data_master/cpu_E.jtag_debug_module baseAddress 0x08010800
add_connection cpu_E.data_master fifo_AE.in avalon
set_connection_parameter_value cpu_E.data_master/fifo_AE.in baseAddress 0x08011144
add_connection cpu_E.data_master fifo_AE.in_csr avalon
set_connection_parameter_value cpu_E.data_master/fifo_AE.in_csr baseAddress 0x08011020
add_connection cpu_E.data_master fifo_AE.out avalon
set_connection_parameter_value cpu_E.data_master/fifo_AE.out baseAddress 0x08011140
add_connection cpu_E.data_master fifo_DE.in avalon
set_connection_parameter_value cpu_E.data_master/fifo_DE.in baseAddress 0x080110c4
add_connection cpu_E.data_master fifo_DE.in_csr avalon
set_connection_parameter_value cpu_E.data_master/fifo_DE.in_csr baseAddress 0x08011000
add_connection cpu_E.data_master fifo_DE.out avalon
set_connection_parameter_value cpu_E.data_master/fifo_DE.out baseAddress 0x080110c0
add_connection cpu_E.data_master fifo_EF.in avalon
set_connection_parameter_value cpu_E.data_master/fifo_EF.in baseAddress 0x080110bc
add_connection cpu_E.data_master fifo_EF.in_csr avalon
set_connection_parameter_value cpu_E.data_master/fifo_EF.in_csr baseAddress 0x08011040
add_connection cpu_E.data_master fifo_EF.out avalon
set_connection_parameter_value cpu_E.data_master/fifo_EF.out baseAddress 0x080110b8
add_connection cpu_E.data_master highTimer_E.s1 avalon
set_connection_parameter_value cpu_E.data_master/highTimer_E.s1 baseAddress 0x08011080
add_connection cpu_E.data_master jtag_E.avalon_jtag_slave avalon
set_connection_parameter_value cpu_E.data_master/jtag_E.avalon_jtag_slave baseAddress 0x080110b0
add_connection cpu_E.data_master led_out.s1 avalon
set_connection_parameter_value cpu_E.data_master/led_out.s1 baseAddress 0x08011100
add_connection cpu_E.data_master PLL.pll_slave avalon
set_connection_parameter_value cpu_E.data_master/PLL.pll_slave baseAddress 0x08011110
add_connection cpu_E.data_master SDRAM_controller.s1 avalon
set_connection_parameter_value cpu_E.data_master/SDRAM_controller.s1 baseAddress 0x0000
add_connection cpu_E.data_master sysid_E.control_slave avalon
set_connection_parameter_value cpu_E.data_master/sysid_E.control_slave baseAddress 0x080110a8
add_connection cpu_E.data_master timer_E.s1 avalon
set_connection_parameter_value cpu_E.data_master/timer_E.s1 baseAddress 0x08011060
add_connection cpu_E.instruction_master cpu_E.jtag_debug_module avalon
set_connection_parameter_value cpu_E.instruction_master/cpu_E.jtag_debug_module baseAddress 0x08010800
add_connection cpu_E.instruction_master jtag_E.avalon_jtag_slave avalon
set_connection_parameter_value cpu_E.instruction_master/jtag_E.avalon_jtag_slave baseAddress 0x080110b0
add_connection cpu_E.instruction_master SDRAM_controller.s1 avalon
set_connection_parameter_value cpu_E.instruction_master/SDRAM_controller.s1 baseAddress 0x0000
add_connection cpu_F.data_master cpu_F.jtag_debug_module avalon
set_connection_parameter_value cpu_F.data_master/cpu_F.jtag_debug_module baseAddress 0x08010800
add_connection cpu_F.data_master fifo_AF.in avalon
set_connection_parameter_value cpu_F.data_master/fifo_AF.in baseAddress 0x0801113c
add_connection cpu_F.data_master fifo_AF.in_csr avalon
set_connection_parameter_value cpu_F.data_master/fifo_AF.in_csr baseAddress 0x08011000
add_connection cpu_F.data_master fifo_AF.out avalon
set_connection_parameter_value cpu_F.data_master/fifo_AF.out baseAddress 0x08011138
add_connection cpu_F.data_master fifo_EF.in avalon
set_connection_parameter_value cpu_F.data_master/fifo_EF.in baseAddress 0x080110bc
add_connection cpu_F.data_master fifo_EF.in_csr avalon
set_connection_parameter_value cpu_F.data_master/fifo_EF.in_csr baseAddress 0x08011040
add_connection cpu_F.data_master fifo_EF.out avalon
set_connection_parameter_value cpu_F.data_master/fifo_EF.out baseAddress 0x080110b8
add_connection cpu_F.data_master highTimer_F.s1 avalon
set_connection_parameter_value cpu_F.data_master/highTimer_F.s1 baseAddress 0x08011060
add_connection cpu_F.data_master jtag_F.avalon_jtag_slave avalon
set_connection_parameter_value cpu_F.data_master/jtag_F.avalon_jtag_slave baseAddress 0x08011090
add_connection cpu_F.data_master led_out.s1 avalon
set_connection_parameter_value cpu_F.data_master/led_out.s1 baseAddress 0x08011100
add_connection cpu_F.data_master PLL.pll_slave avalon
set_connection_parameter_value cpu_F.data_master/PLL.pll_slave baseAddress 0x08011110
add_connection cpu_F.data_master SDRAM_controller.s1 avalon
set_connection_parameter_value cpu_F.data_master/SDRAM_controller.s1 baseAddress 0x0000
add_connection cpu_F.data_master sysid_F.control_slave avalon
set_connection_parameter_value cpu_F.data_master/sysid_F.control_slave baseAddress 0x08011088
add_connection cpu_F.data_master timer_F.s1 avalon
set_connection_parameter_value cpu_F.data_master/timer_F.s1 baseAddress 0x08011020
add_connection cpu_F.instruction_master cpu_F.jtag_debug_module avalon
set_connection_parameter_value cpu_F.instruction_master/cpu_F.jtag_debug_module baseAddress 0x08010800
add_connection cpu_F.instruction_master jtag_F.avalon_jtag_slave avalon
set_connection_parameter_value cpu_F.instruction_master/jtag_F.avalon_jtag_slave baseAddress 0x08011090
add_connection cpu_F.instruction_master SDRAM_controller.s1 avalon
set_connection_parameter_value cpu_F.instruction_master/SDRAM_controller.s1 baseAddress 0x0000
add_connection cpu_A.d_irq fifo_AB_0.in_irq interrupt
set_connection_parameter_value cpu_A.d_irq/fifo_AB_0.in_irq irqNumber 3
add_connection cpu_A.d_irq fifo_AB_1.in_irq interrupt
set_connection_parameter_value cpu_A.d_irq/fifo_AB_1.in_irq irqNumber 5
add_connection cpu_A.d_irq fifo_AB_2.in_irq interrupt
set_connection_parameter_value cpu_A.d_irq/fifo_AB_2.in_irq irqNumber 4
add_connection cpu_A.d_irq fifo_AD.in_irq interrupt
set_connection_parameter_value cpu_A.d_irq/fifo_AD.in_irq irqNumber 6
add_connection cpu_A.d_irq fifo_AE.in_irq interrupt
set_connection_parameter_value cpu_A.d_irq/fifo_AE.in_irq irqNumber 8
add_connection cpu_A.d_irq fifo_AF.in_irq interrupt
set_connection_parameter_value cpu_A.d_irq/fifo_AF.in_irq irqNumber 7
add_connection cpu_A.d_irq highTimer_A.irq interrupt
set_connection_parameter_value cpu_A.d_irq/highTimer_A.irq irqNumber 2
add_connection cpu_A.d_irq jtag_A.irq interrupt
set_connection_parameter_value cpu_A.d_irq/jtag_A.irq irqNumber 1
add_connection cpu_A.d_irq timer_A.irq interrupt
set_connection_parameter_value cpu_A.d_irq/timer_A.irq irqNumber 0
add_connection cpu_B.d_irq fifo_BC.in_irq interrupt
set_connection_parameter_value cpu_B.d_irq/fifo_BC.in_irq irqNumber 3
add_connection cpu_B.d_irq highTimer_B.irq interrupt
set_connection_parameter_value cpu_B.d_irq/highTimer_B.irq irqNumber 0
add_connection cpu_B.d_irq jtag_B.irq interrupt
set_connection_parameter_value cpu_B.d_irq/jtag_B.irq irqNumber 2
add_connection cpu_B.d_irq timer_B.irq interrupt
set_connection_parameter_value cpu_B.d_irq/timer_B.irq irqNumber 1
add_connection cpu_C.d_irq fifo_CD.in_irq interrupt
set_connection_parameter_value cpu_C.d_irq/fifo_CD.in_irq irqNumber 3
add_connection cpu_C.d_irq highTimer_C.irq interrupt
set_connection_parameter_value cpu_C.d_irq/highTimer_C.irq irqNumber 1
add_connection cpu_C.d_irq jtag_C.irq interrupt
set_connection_parameter_value cpu_C.d_irq/jtag_C.irq irqNumber 2
add_connection cpu_C.d_irq timer_C.irq interrupt
set_connection_parameter_value cpu_C.d_irq/timer_C.irq irqNumber 0
add_connection cpu_D.d_irq fifo_AD.in_irq interrupt
set_connection_parameter_value cpu_D.d_irq/fifo_AD.in_irq irqNumber 4
add_connection cpu_D.d_irq fifo_DE.in_irq interrupt
set_connection_parameter_value cpu_D.d_irq/fifo_DE.in_irq irqNumber 3
add_connection cpu_D.d_irq highTimer_D.irq interrupt
set_connection_parameter_value cpu_D.d_irq/highTimer_D.irq irqNumber 1
add_connection cpu_D.d_irq jtag_D.irq interrupt
set_connection_parameter_value cpu_D.d_irq/jtag_D.irq irqNumber 2
add_connection cpu_D.d_irq timer_D.irq interrupt
set_connection_parameter_value cpu_D.d_irq/timer_D.irq irqNumber 0
add_connection cpu_E.d_irq fifo_EF.in_irq interrupt
set_connection_parameter_value cpu_E.d_irq/fifo_EF.in_irq irqNumber 3
add_connection cpu_E.d_irq highTimer_E.irq interrupt
set_connection_parameter_value cpu_E.d_irq/highTimer_E.irq irqNumber 1
add_connection cpu_E.d_irq jtag_E.irq interrupt
set_connection_parameter_value cpu_E.d_irq/jtag_E.irq irqNumber 2
add_connection cpu_E.d_irq timer_E.irq interrupt
set_connection_parameter_value cpu_E.d_irq/timer_E.irq irqNumber 0
add_connection cpu_F.d_irq highTimer_F.irq interrupt
set_connection_parameter_value cpu_F.d_irq/highTimer_F.irq irqNumber 1
add_connection cpu_F.d_irq jtag_F.irq interrupt
set_connection_parameter_value cpu_F.d_irq/jtag_F.irq irqNumber 2
add_connection cpu_F.d_irq timer_F.irq interrupt
set_connection_parameter_value cpu_F.d_irq/timer_F.irq irqNumber 0

# exported interfaces
add_interface clk clock sink
set_interface_property clk EXPORT_OF clock.clk_in
add_interface reset reset sink
set_interface_property reset EXPORT_OF clock.clk_in_reset
add_interface pll_c2 clock source
set_interface_property pll_c2 EXPORT_OF PLL.c2
add_interface led_out conduit end
set_interface_property led_out EXPORT_OF led_out.external_connection
add_interface sdram_bus conduit end
set_interface_property sdram_bus EXPORT_OF SDRAM_controller.wire
add_interface pll_c1_conduit conduit end
set_interface_property pll_c1_conduit EXPORT_OF PLL.c1_conduit
add_interface pll_locked_conduit conduit end
set_interface_property pll_locked_conduit EXPORT_OF PLL.locked_conduit
add_interface pll_phasedone_conduit conduit end
set_interface_property pll_phasedone_conduit EXPORT_OF PLL.phasedone_conduit
add_interface pll_areset_conduit conduit end
set_interface_property pll_areset_conduit EXPORT_OF PLL.areset_conduit

set_interconnect_requirement {$system} qsys_mm.clockCrossingAdapter HANDSHAKE
set_interconnect_requirement {$system} qsys_mm.maxAdditionalLatency 1
set_interconnect_requirement {$system} qsys_mm.insertDefaultSlave false

save_system HwJSoC.qsys
